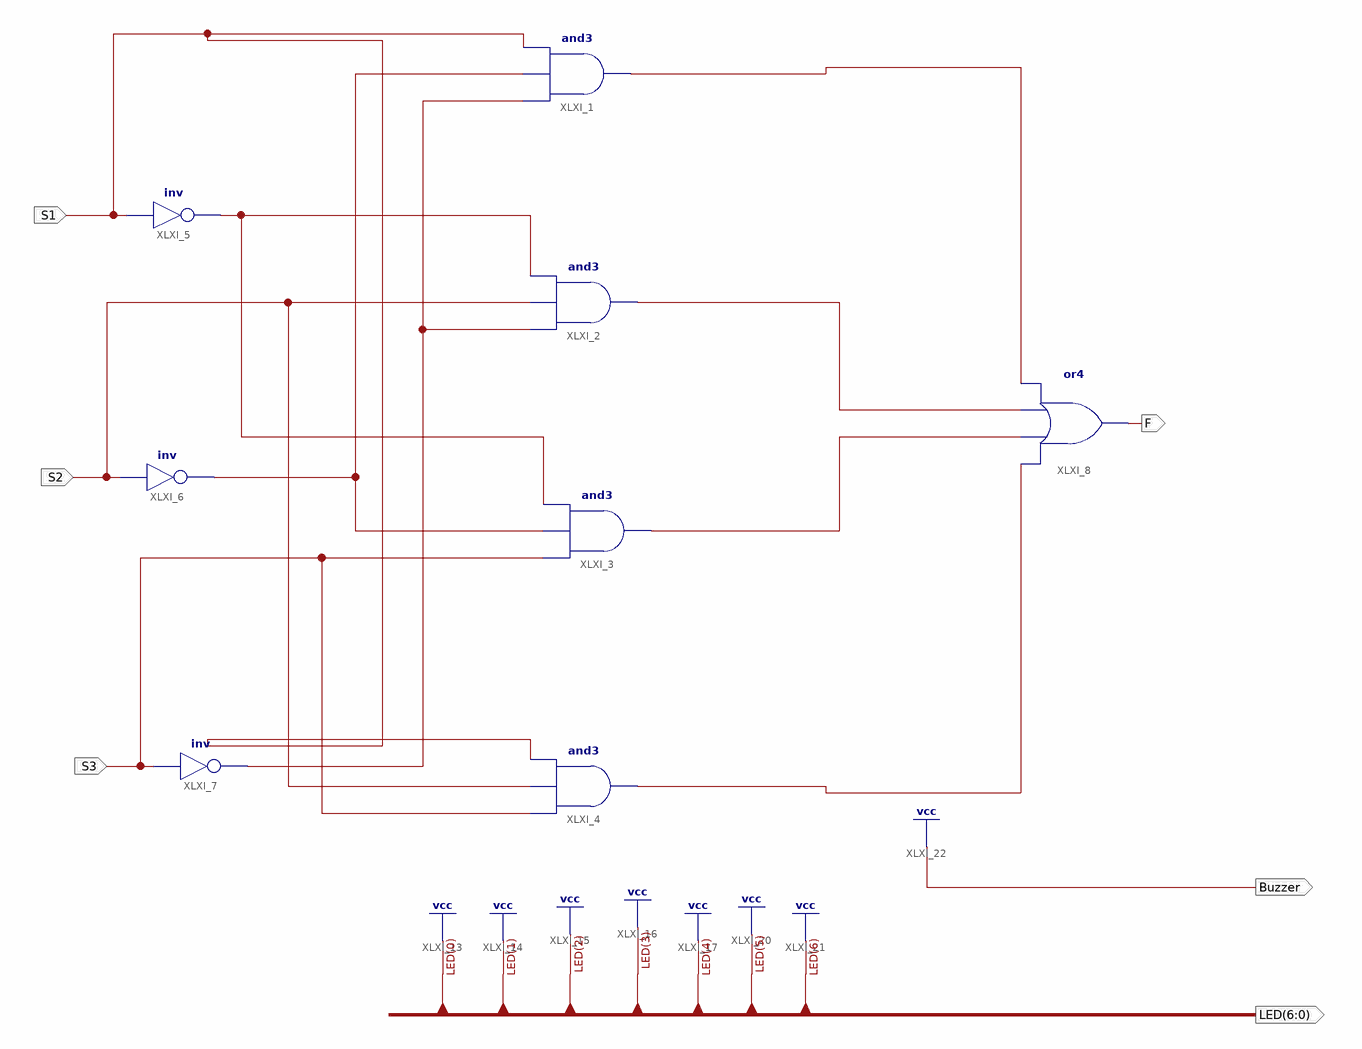
[diagram p0: schematic sheet 1]
// Xilinx ISE schematic LampCtrl_Draw_1.sch (kintex7) as structural Verilog: 8 symbols, 6 ports
module LampCtrl_Draw_1 (
  input  S2,
  input  S3,
  input  S1,
  output F,
  output [6:0] LED,
  output Buzzer
);

  wire XLXN_3, XLXN_7, XLXN_9, XLXN_10, XLXN_17, XLXN_18, XLXN_23;

  and XLXI_1 (XLXN_3, XLXN_23, XLXN_17, S1);
  and XLXI_2 (XLXN_10, XLXN_23, S2, XLXN_18);
  and XLXI_3 (XLXN_7, S3, XLXN_17, XLXN_18);
  and XLXI_4 (XLXN_9, S3, S2, S1);
  not XLXI_5 (XLXN_18, S1);
  not XLXI_6 (XLXN_17, S2);
  not XLXI_7 (XLXN_23, S3);
  or XLXI_8 (F, XLXN_9, XLXN_7, XLXN_10, XLXN_3);

  assign Buzzer = 1'b1;
  assign LED = {7{1'b1}};
endmodule
